# Altium schematic sheet SCH1_Connectors.SchDoc
size B; Organization: CWRUbotix; Address1: 10900 Euclid Avenue; Address2: Cleveland, OH 44106; Address3: USA
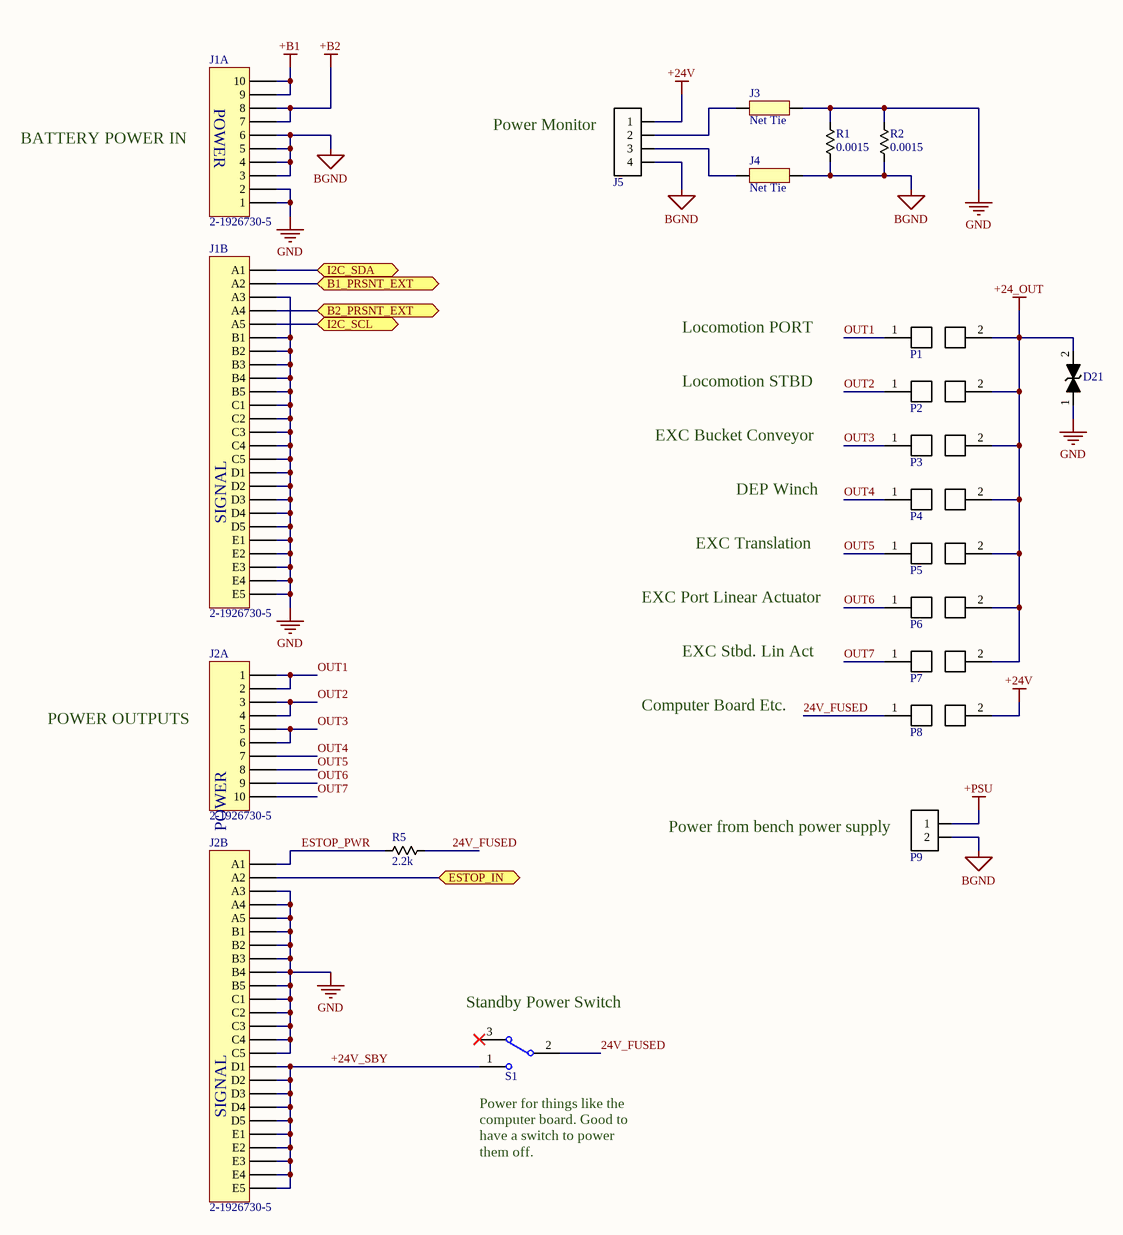
[diagram p0: SCH1_Connectors.SchDoc]

## Parts
D21  diode_5  [do-214ab]  (value not drawn)
J1  2-1926730-5  [TE_CONN_2-1926730-5]  (parts A,B of 2)
J2  2-1926730-5  [TE_CONN_2-1926730-5]  (parts A,B of 2)
J3  Net Tie  [net_tie_0]
J4  Net Tie  [net_tie_0]
J5  conn-4x1_0  [PHOENIX_1757268]  (value not drawn)
P1  conn-fuse-holder_0  [FUSE_HOLDER_KEYSTONE_3557-2]  (value not drawn)
P2  conn-fuse-holder_0  [FUSE_HOLDER_KEYSTONE_3557-2]  (value not drawn)
P3  conn-fuse-holder_0  [FUSE_HOLDER_KEYSTONE_3557-2]  (value not drawn)
P4  conn-fuse-holder_0  [FUSE_HOLDER_KEYSTONE_3557-2]  (value not drawn)
P5  conn-fuse-holder_0  [FUSE_HOLDER_KEYSTONE_3557-2]  (value not drawn)
P6  conn-fuse-holder_0  [FUSE_HOLDER_KEYSTONE_3557-2]  (value not drawn)
P7  conn-fuse-holder_0  [FUSE_HOLDER_KEYSTONE_3557-2]  (value not drawn)
P8  conn-fuse-holder_0  [FUSE_HOLDER_KEYSTONE_3557-2]  (value not drawn)
P9  conn-2x1_0  [PHOENIX_1757242]  (value not drawn)
R1  0.0015  [chip_2512]
R2  0.0015  [chip_2512]
R5  2.2k  [chip_0805]
S1  SW-SPDT  [M2012TXG41-DC]  (value not drawn)

## Ports
B1_PRSNT_EXT (bidir), B2_PRSNT_EXT (bidir), ESTOP_IN (bidir), I2C_SCL (bidir), I2C_SDA (bidir)

## Nets
+24_OUT: D21.2 P1.2 P2.2 P3.2 P4.2 P5.2 P6.2 P7.2
+24V: J5.1 P8.2
+B1: J1.9 J1.10
+B2: J1.7 J1.8
+PSU: P9.1
BGND: J1.3 J1.4 J1.5 J1.6 J4.2(NET2) J5.4 P9.2 R1.2 R2.2
GND: D21.1 J1.1 J1.2 J1.A3 J1.B1 J1.B2 J1.B3 J1.B4 J1.B5 J1.C1 J1.C2 J1.C3 J1.C4 J1.C5 J1.D1 J1.D2 J1.D3 J1.D4 J1.D5 J1.E1 J1.E2 J1.E3 J1.E4 J1.E5 J2.A3 J2.A4 J2.A5 J2.B1 J2.B2 J2.B3 J2.B4 J2.B5 J2.C1 J2.C2 J2.C3 J2.C4 J2.C5 J3.2(NET2) R1.1 R2.1
24V_FUSED: P8.1 R5.2 S1.2
+24V_SBY: J2.D1 J2.D2 J2.D3 J2.D4 J2.D5 J2.E1 J2.E2 J2.E3 J2.E4 J2.E5 S1.1
B1_PRSNT_EXT: J1.A2 ; port B1_PRSNT_EXT
B2_PRSNT_EXT: J1.A4 ; port B2_PRSNT_EXT
ESTOP_IN: J2.A2 ; port ESTOP_IN
ESTOP_PWR: J2.A1 R5.1
I2C_SCL: J1.A5 ; port I2C_SCL
I2C_SDA: J1.A1 ; port I2C_SDA
OUT1: J2.1 J2.2 P1.1
OUT2: J2.3 J2.4 P2.1
OUT3: J2.5 J2.6 P3.1
OUT4: J2.7 P4.1
OUT5: J2.8 P5.1
OUT6: J2.9 P6.1
OUT7: J2.10 P7.1
NetJ3_1: J3.1(NET1) J5.2
NetJ4_1: J4.1(NET1) J5.3

Not connected (* = marked no-connect by the designer): S1 3*

## Notes on the sheet
- BATTERY POWER IN
- (near J5) Power Monitor
- Locomotion PORT
- Locomotion STBD
- EXC Bucket Conveyor
- DEP Winch
- EXC Translation
- EXC Port Linear Actuator
- EXC Stbd. Lin Act
- POWER OUTPUTS
- Computer Board Etc.
- (near P9) Power from bench power supply
- (near S1) Standby Power Switch
- (near S1) Power for things like the computer board. Good to have a switch to power them off.
- Title
- Size:
- B
- Number:
- Revision:
- Date:
- Sheet
- of
- (in symbol CONN-00093, part A) POWER
- (in symbol CONN-00093, part B) SIGNAL

## Library data of the parts
D21 = DIO-00090: TVS, 28V, 45.5V@66A, 3kW 66A Peak, Bidirectional, DO-214AC; Manufacturer: ST; Manufacturer PN: SMC30J28CA; Reverse Breakdown Voltage: 31.1V; Power Rating: 3000W; Part Number: DIO-00090; Current Rating: 66A; Type: TVS; Cost: 1.2; Distributor Link: https://www.digikey.com/en/products/detail/stmicroelectronics/SMC30J28CA/2826980
J1 J2 = CONN-00093: Backplane Header, Blades and Pins, Edge Mount Right Angle, 10 Power 25 Signal; Manufacturer: TE Connectivity; Positions per level: 35; Levels: 1; Part Number: CONN-00093; Type: Header; Manufacturer PN: 2-1926730-5; Cost: 11.68
J3 J4 = MISC-00039: Part Number: MISC-00039
J5 = CONN-00096: Terminal Block Header, 4 pos, 12A 300V, Right-Angle, THT; Manufacturer: Phoenix Contact; Manufacturer PN: 1757268; Positions per level: 4; Levels: 1; Part Number: CONN-00096; Type: Terminal Block; Cost: 1.4
P1-P8 = CONN-00015: Fuse Holder, 30A, 500V, LP-Mini 897, ATOF 257; Manufacturer: Keystone Electronics; Manufacturer PN: 3557-2; Positions per level: 2; Levels: 1; Current: 30; Part Number: CONN-00015; Cost: 1.03
P9 = CONN-00102: Terminal Blk Header, 2 Pos, 5.08mm, 12A, Right-Angle; Manufacturer: Phoenix Contact; Manufacturer PN: 1757242; Positions per level: 2; Levels: 1; Part Number: CONN-00102; Type: Terminal Block; Cost: 0.64
R1 R2 = RES-00716: RES SMD 0.0015 OHM 1% 3W 2512 50ppm, Current Sense; Manufacturer: TE Connectivity; Manufacturer PN: TLR3A30DR0015FTDG; Part Number: RES-00716; Resistance: 0.0015; Tolerance: 1%; Power Rating: 3W; Cost: 1.04
R5 = RES-00366: RES SMD 2.2K OHM 1% 1/8W 0805; Manufacturer: Rohm Semiconductor; Manufacturer PN: KTR10EZPF2201; Power Rating: 0.125W; Part Number: RES-00366; Resistance: 2.2k; Tolerance: 1%
S1 = MISC-00009: Switch, SPDT, Rocker, Thru-hole, Right-angle; Manufacturer: NKK Switches; Manufacturer PN: M2012TXW41-DA; Part Number: MISC-00009; Cost: 5.1; Weight: 6